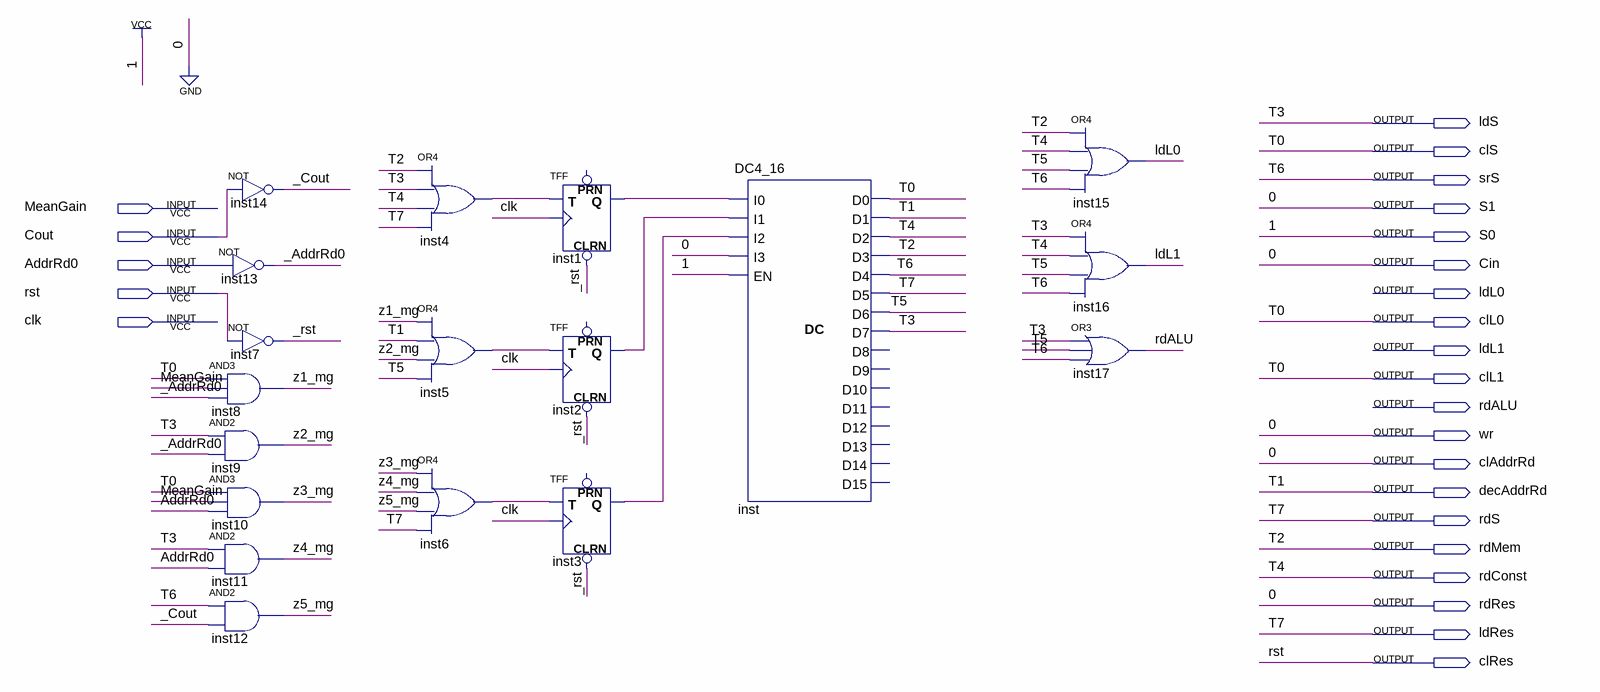
[diagram p0: schematic sheet]
// Quartus schematic MeanGain_upravljacka_jedinica.bdf as structural Verilog: 18 symbols, 25 pins
module MeanGain_upravljacka_jedinica (
  input  MeanGain,
  input  Cout,
  input  AddrRd0,
  input  rst,
  input  clk,
  output ldS,
  output clS,
  output srS,
  output S1,
  output S0,
  output Cin,
  output ldL0,
  output clL0,
  output ldL1,
  output clL1,
  output rdALU,
  output wr,
  output clAddrRd,
  output decAddrRd,
  output rdS,
  output rdMem,
  output rdConst,
  output rdRes,
  output ldRes,
  output clRes
);

  wire _AddrRd0, _Cout, _rst, inst1_q, inst2_q, inst3_q, inst4_out, inst5_out, inst6_out, T5, z1_mg, z2_mg,
       z3_mg, z4_mg, z5_mg;

  not inst14 (_Cout, Cout);
  not inst13 (_AddrRd0, AddrRd0);
  not inst7 (_rst, rst);
  and inst8 (z1_mg, clL0, MeanGain, _AddrRd0);
  and inst9 (z2_mg, ldS, _AddrRd0);
  and inst10 (z3_mg, clL0, MeanGain, AddrRd0);
  and inst11 (z4_mg, ldS, AddrRd0);
  and inst12 (z5_mg, srS, _Cout);
  or inst4 (inst4_out, rdMem, ldS, rdConst, ldRes);
  or inst5 (inst5_out, z1_mg, decAddrRd, z2_mg, T5);
  or inst6 (inst6_out, z3_mg, z4_mg, z5_mg, ldRes);
  TFF inst1 (.CLRN(_rst), .T(inst4_out), .CLK(clk), .Q(inst1_q));  // open: PRN
  TFF inst2 (.CLRN(_rst), .T(inst5_out), .CLK(clk), .Q(inst2_q));  // open: PRN
  TFF inst3 (.CLRN(_rst), .T(inst6_out), .CLK(clk), .Q(inst3_q));  // open: PRN
  DC4_16 inst (
    .I0(inst1_q), .I1(inst2_q), .I2(inst3_q), .I3(1'b0), .EN(1'b1), .D0(clL0), .D1(decAddrRd), .D2(rdConst),
    .D3(rdMem), .D4(srS), .D5(ldRes), .D6(T5), .D7(ldS));  // open: D8, D9, D10, D11, D12, D13, D14, D15
  or inst15 (ldL0, rdMem, rdConst, T5, srS);
  or inst16 (ldL1, ldS, rdConst, T5, srS);
  or inst17 (rdALU, ldS, T5, srS);

  assign Cin = 1'b0;
  assign clAddrRd = 1'b0;
  assign clL1 = clL0;
  assign clRes = rst;
  assign clS = clL0;
  assign rdRes = 1'b0;
  assign rdS = ldRes;
  assign S0 = 1'b1;
  assign S1 = 1'b0;
  assign wr = 1'b0;

  // Other names for the same wires on the sheet: T0 = clL0; T1 = decAddrRd; T2 = rdMem; T3 = ldS; T4 = rdConst;
  //   T6 = srS; T7 = ldRes
endmodule
